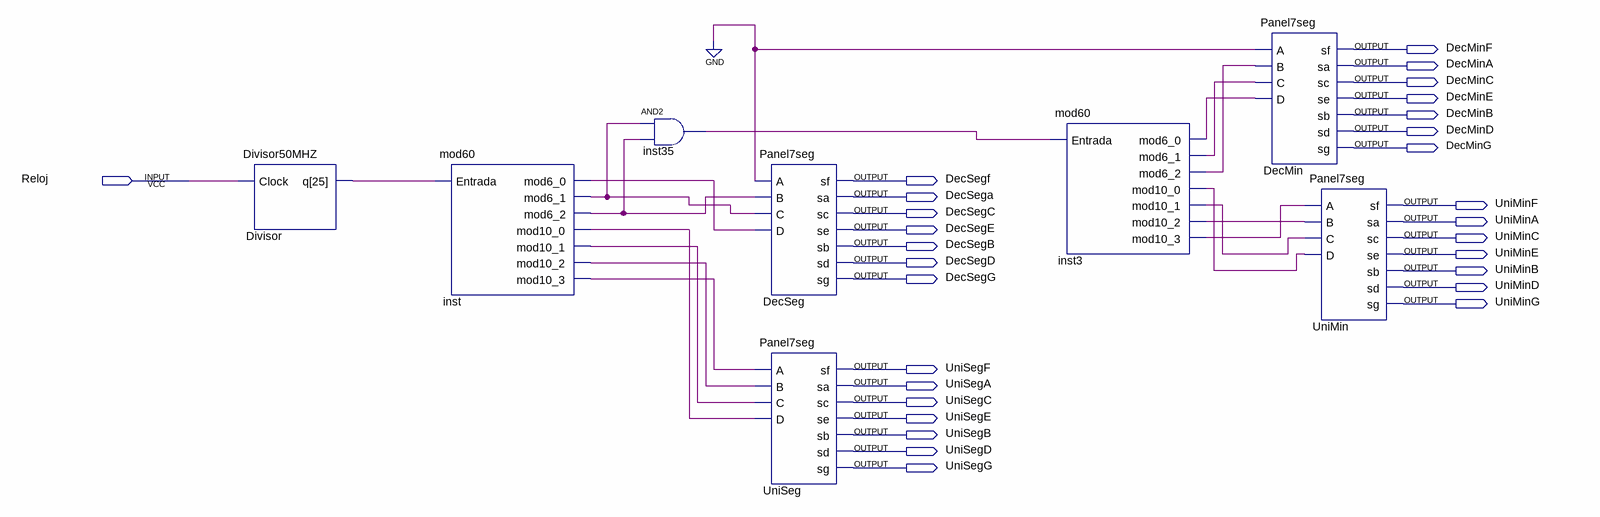
[diagram p0: schematic sheet]
// Quartus schematic ModDoble60con7segmentos.bdf as structural Verilog: 8 symbols, 29 pins
module ModDoble60con7segmentos (
  input  Reloj,
  output DecMinF,
  output DecMinA,
  output DecMinC,
  output DecMinE,
  output DecMinB,
  output DecMinD,
  output DecMinG,
  output DecSegf,
  output DecSega,
  output UniMinF,
  output DecSegC,
  output UniMinA,
  output DecSegE,
  output UniMinC,
  output DecSegB,
  output UniMinE,
  output DecSegD,
  output UniMinB,
  output DecSegG,
  output UniMinD,
  output UniMinG,
  output UniSegF,
  output UniSegA,
  output UniSegC,
  output UniSegE,
  output UniSegB,
  output UniSegD,
  output UniSegG
);

  wire Divisor_q, inst3_mod6_0, inst3_mod6_1, inst3_mod6_2, inst3_mod10_0, inst3_mod10_1, inst3_mod10_2,
       inst3_mod10_3, inst35_out, inst_mod6_0, inst_mod6_1, inst_mod6_2, inst_mod10_0, inst_mod10_1,
       inst_mod10_2, inst_mod10_3;

  Divisor50MHZ Divisor (.Clock(Reloj), .q(Divisor_q));
  mod60 inst (
    .Entrada(Divisor_q), .mod6_0(inst_mod6_0), .mod6_1(inst_mod6_1), .mod6_2(inst_mod6_2),
    .mod10_0(inst_mod10_0), .mod10_1(inst_mod10_1), .mod10_2(inst_mod10_2), .mod10_3(inst_mod10_3));
  and inst35 (inst35_out, inst_mod6_1, inst_mod6_2);
  Panel7seg DecSeg (
    .A(1'b0), .B(inst_mod6_2), .C(inst_mod6_1), .D(inst_mod6_0), .sf(DecSegf), .sa(DecSega), .sc(DecSegC),
    .se(DecSegE), .sb(DecSegB), .sd(DecSegD), .sg(DecSegG));
  Panel7seg UniSeg (
    .A(inst_mod10_3), .B(inst_mod10_2), .C(inst_mod10_1), .D(inst_mod10_0), .sf(UniSegF), .sa(UniSegA),
    .sc(UniSegC), .se(UniSegE), .sb(UniSegB), .sd(UniSegD), .sg(UniSegG));
  mod60 inst3 (
    .Entrada(inst35_out), .mod6_0(inst3_mod6_0), .mod6_1(inst3_mod6_1), .mod6_2(inst3_mod6_2),
    .mod10_0(inst3_mod10_0), .mod10_1(inst3_mod10_1), .mod10_2(inst3_mod10_2), .mod10_3(inst3_mod10_3));
  Panel7seg DecMin (
    .A(1'b0), .B(inst3_mod6_2), .C(inst3_mod6_1), .D(inst3_mod6_0), .sf(DecMinF), .sa(DecMinA), .sc(DecMinC),
    .se(DecMinE), .sb(DecMinB), .sd(DecMinD), .sg(DecMinG));
  Panel7seg UniMin (
    .A(inst3_mod10_3), .B(inst3_mod10_2), .C(inst3_mod10_1), .D(inst3_mod10_0), .sf(UniMinF), .sa(UniMinA),
    .sc(UniMinC), .se(UniMinE), .sb(UniMinB), .sd(UniMinD), .sg(UniMinG));
endmodule
